# EAGLE design TreeV1Part2 (EAGLE 6.5.0)
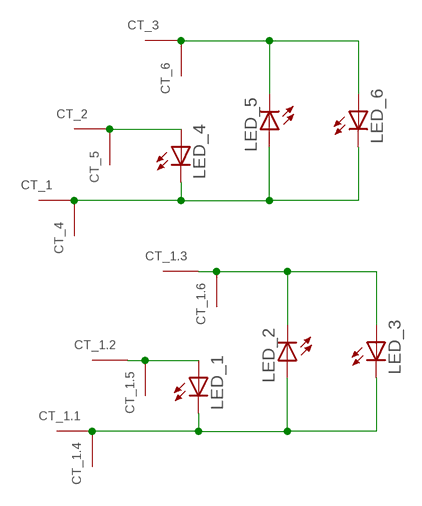
[diagram p0: schematic, sheet 1]

## Parts
CT_1  SMD_PAD_SINGLE  [5X5TREEPAD_SINGLE]
CT_1.1  SMD_PAD_SINGLE  [5X5TREEPAD_SINGLE]
CT_1.2  SMD_PAD_SINGLE  [5X5TREEPAD_SINGLE]
CT_1.3  SMD_PAD_SINGLE  [5X5TREEPAD_SINGLE]
CT_1.4  SMD_PAD_SINGLE  [5X5TREEPAD_SINGLE]
CT_1.5  SMD_PAD_SINGLE  [5X5TREEPAD_SINGLE]
CT_1.6  SMD_PAD_SINGLE  [5X5TREEPAD_SINGLE]
CT_2  SMD_PAD_SINGLE  [5X5TREEPAD_SINGLE]
CT_3  SMD_PAD_SINGLE  [5X5TREEPAD_SINGLE]
CT_4  SMD_PAD_SINGLE  [5X5TREEPAD_SINGLE]
CT_5  SMD_PAD_SINGLE  [5X5TREEPAD_SINGLE]
CT_6  SMD_PAD_SINGLE  [5X5TREEPAD_SINGLE]
LED_1  LEDLED_CLEAN_EDGE  [1X02_NO_SILK]
LED_2  LEDLED_CLEAN_EDGE  [1X02_NO_SILK]
LED_3  LEDLED_CLEAN_EDGE  [1X02_NO_SILK]
LED_4  LEDLED_CLEAN_EDGE  [1X02_NO_SILK]
LED_5  LEDLED_CLEAN_EDGE  [1X02_NO_SILK]
LED_6  LEDLED_CLEAN_EDGE  [1X02_NO_SILK]

## Nets
N$1: CT_3.P$1 CT_6.P$1 LED_5.2(C) LED_6.1(A)
N$2: CT_1.P$1 CT_4.P$1 LED_4.2(C) LED_5.1(A) LED_6.2(C)
N$3: CT_1.3.P$1 CT_1.6.P$1 LED_2.2(C) LED_3.1(A)
N$4: CT_2.P$1 CT_5.P$1 LED_4.1(A)
N$5: CT_1.1.P$1 CT_1.4.P$1 LED_1.2(C) LED_2.1(A) LED_3.2(C)
N$6: CT_1.2.P$1 CT_1.5.P$1 LED_1.1(A)

## Library data of the parts
CT_1 CT_1.1-CT_1.6 CT_2-CT_6 = Christmas2014Custom:SMD_PAD_SINGLE
LED_1-LED_6 = BergCustom:LED: LED OSRAM: - CHIPLED LG R971, LG N971, LY N971, LG Q971, LY Q971, LO R971, LY R971 LH N974, LH R974 LS Q976, LO Q976, LY Q976 LO Q996 - Hyper CHIPLED LW Q18S LB Q993, LB Q99A, LB R99A - SideLED LS A670, LO A670, LY A670, LG A670, LP A670 LB A673, LV A673, LT A673, LW A673 LH A674 LY A675 LS A676, LA A676, LO A676, LY A676, LW A676 LS A679, LY A679, LG A679 - Hyper Micro SIDELED® LS Y876, LA Y876, LO Y876, LY Y876 LT Y87S - SmartLED LW L88C, LW L88S LB L89C, LB L89S, LG L890 LS L89K, LO L89K, LY L89K LS L896, LA L896, LO L896, LY L896 - TOPLED LS T670, LO T670, LY T670, LG T670, LP T670 LSG T670, LSP T670, LSY T670, LOP T670, LYG T670 LG T671, LOG T671, LSG T671 LB T673, LV T673, LT T673, LW T673 LH T674 LS T676, LA T676, LO T676, LY T676, LB T676, LH T676, LSB T676, LW T676 LB T67C, LV T67C, LT T67C, LS T67K, LO T67K, LY T67K, LW E67C LS E67B, LA E67B, LO E67B, LY E67B, LB E67C, LV E67C, LT E67C LW T67C LS T679, LY T679, LG T679 LS T770, LO T770, LY T770, LG T770, LP T770 LB T773, LV T773, LT T773, LW T773 LH T774 LS E675, LA E675, LY E675, LS T675 LS T776, LA T776, LO T776, LY T776, LB T776 LHGB T686 LT T68C, LB T68C - Hyper Mini TOPLED® LB M676 - Mini TOPLED Santana® LG M470 LS M47K, LO M47K, LY M47K Source: http://www.osram.convergy.de LUXEON: - LUMILED® LXK2-PW12-R00, LXK2-PW12-S00, LXK2-PW14-U00, LXK2-PW14-V00 LXK2-PM12-R00, LXK2-PM12-S00, LXK2-PM14-U00 LXK2-PE12-Q00, LXK2-PE12-R00, LXK2-PE12-S00, LXK2-PE14-T00, LXK2-PE14-U00 LXK2-PB12-K00, LXK2-PB12-L00, LXK2-PB12-M00, LXK2-PB14-N00, LXK2-PB14-P00, LXK2-PB14-Q00 LXK2-PR12-L00, LXK2-PR12-M00, LXK2-PR14-Q00, LXK2-PR14-R00 LXK2-PD12-Q00, LXK2-PD12-R00, LXK2-PD12-S00 LXK2-PH12-R00, LXK2-PH12-S00 LXK2-PL12-P00, LXK2-PL12-Q00, LXK2-PL12-R00 Source: www.luxeon.com KINGBRIGHT: KA-3528ASYC Source: www.kingbright.com

## Board
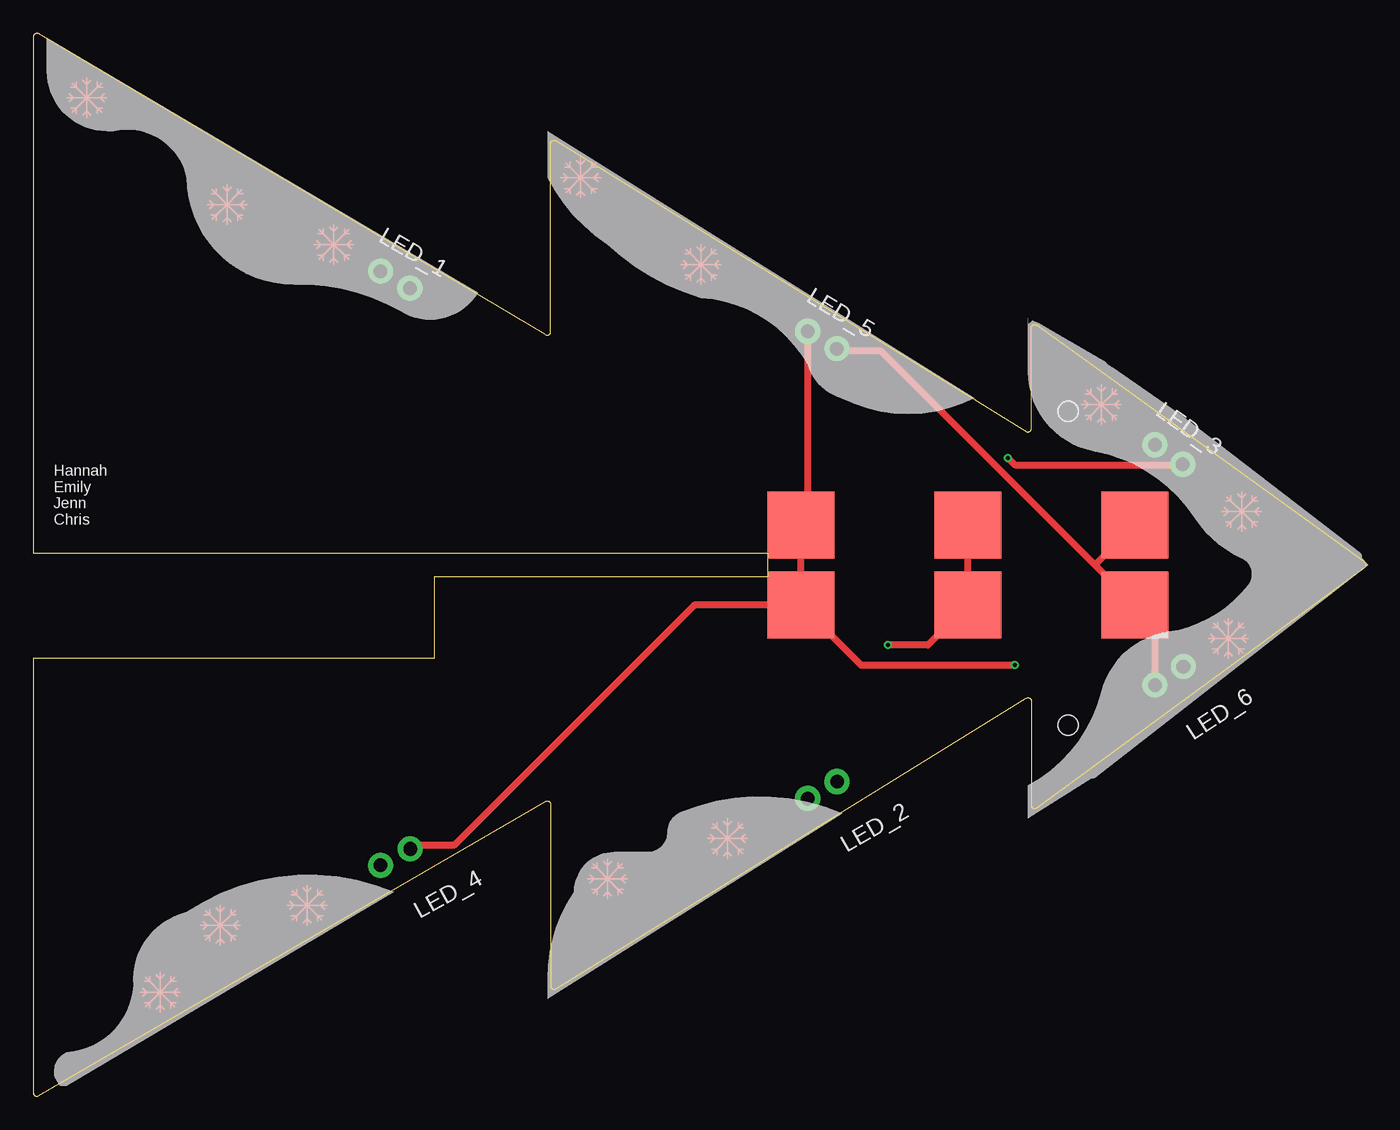
[diagram p1: board, top side]
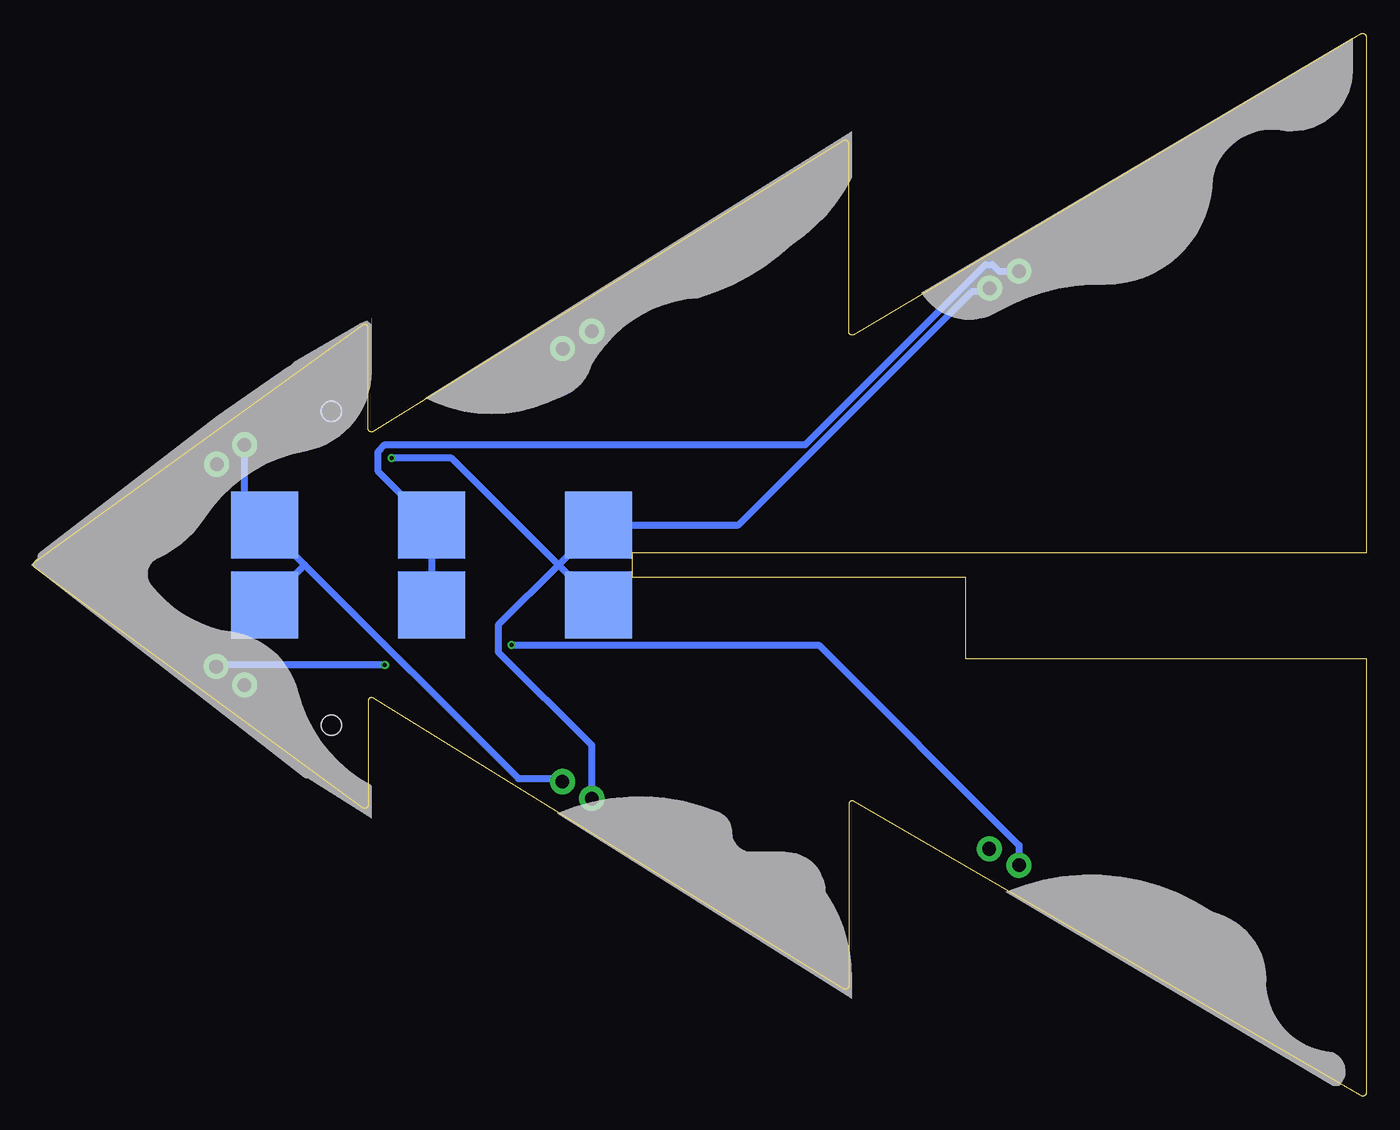
[diagram p2: board, bottom side, seen from below]

Size 99.82 x 79.62 mm. Coordinates in mm from the lower left corner, seen from the top.
Copper layers (1*16): Top 0.035mm / dielectric 1.5mm / Bottom 0.035mm
Design rules "Elecrow_2-layer_eagle_rule *": minimum track width 20mil, minimum drill 12mil, track to track 6mil, track to pad 6mil, pad to pad 6mil, via to via 6mil, smd to smd 0mil, copper to edge 10mil, drill to drill 10mil, minimum pad ring 10mil, minimum via ring 6mil, stop-mask expansion 2mil, vias tented up to drill 100mil, thermal gap 10mil
Holes 1.5 mm at 77.5,51.3 77.5,27.8

### Footprints (pad centres in the part's own frame; a part is rotated, then mirrored left to right if it is on the bottom)
5X5TREEPAD_SINGLE = smd 5 x 5: P$1 0,0
1X02_NO_SILK = drill 1.016 pad 1.88: 1 0,0; 2 2.54,0

### Placement (x,y rotation side)
CT_1  57.5,36.8 0 top
CT_1.1  57.5,36.8 0 bottom
CT_1.2  70,36.8 0 bottom
CT_1.3  82.5,36.8 0 bottom
CT_1.4  57.5,42.8 0 bottom
CT_1.5  70,42.8 0 bottom
CT_1.6  82.5,42.8 0 bottom
CT_2  70,36.8 0 top
CT_3  82.5,36.8 0 top
CT_4  57.5,42.8 0 top
CT_5  70,42.8 0 top
CT_6  82.5,42.8 0 top
LED_1  26,61.8 330 top
LED_2  58,22.3 30 top
LED_3  84,48.8 325 top
LED_4  26,17.3 29 top
LED_5  58,57.3 329 top
LED_6  84,30.8 33 top
U$1  [TREE_NOBATT]  0,79.81 270 top
U$2  [TREE_SNOW]  0,79.8 270 top
U$3  [SNOWFLAKE_1]  50,62.3 0 top
U$4  [SNOWFLAKE_1]  80,51.8 0 top
U$5  [SNOWFLAKE_1]  90.5,43.8 0 top
U$6  [SNOWFLAKE_1]  89.5,34.3 0 top
U$7  [SNOWFLAKE_1]  52,19.3 0 top
U$8  [SNOWFLAKE_1]  43,16.3 0 top
U$9  [SNOWFLAKE_1]  20.5,14.3 0 top
U$10  [SNOWFLAKE_1]  14,12.8 0 top
U$11  [SNOWFLAKE_1]  9.5,7.8 0 top
U$12  [SNOWFLAKE_1]  41,68.8 0 top
U$13  [SNOWFLAKE_1]  22.5,63.8 0 top
U$14  [SNOWFLAKE_1]  14.5,66.8 0 top
U$15  [SNOWFLAKE_1]  4,74.8 0 top

### Tracks (layer width: path | path; a pad name or v marks a point on that pad's centre or on a via)
N$1
  Top 0.508: LED_6.1 84,35.3 CT_3.P$1 79.5,39.8 | 79.5,39.8 63.5,55.8 60.5,55.8 LED_5.2 | 79.5,39.8 CT_6.P$1
N$2  (via drill 0.3)
  Top 0.508: LED_5.1 58,43.3 CT_4.P$1 CT_1.P$1 | CT_1.P$1 49.5,36.8 31.5,18.8 28.5,18.8 LED_4.2 | v73.5,32.3 62,32.3 CT_1.P$1
  Bottom 0.508: v73.5,32.3 86,32.3 LED_6.2
N$3
  Bottom 0.508: 79.5,39.8 CT_1.6.P$1 84,44.3 LED_3.1 | 79.5,39.8 63.5,23.8 60.5,23.8 LED_2.2 | 79.5,39.8 CT_1.3.P$1
N$4  (via drill 0.3)
  Top 0.508: v64,33.8 67,33.8 CT_2.P$1 CT_5.P$1
  Bottom 0.508: LED_4.1 26,18.8 41,33.8 v64,33.8
N$5  (via drill 0.3)
  Top 0.508: v73,47.8 73.5,47.3 86,47.3 LED_3.2
  Bottom 0.508: LED_1.2 28.5,60.3 29.5,60.3 47,42.8 CT_1.4.P$1 60.5,39.8 | LED_2.1 58,26.3 65,33.3 65,35.3 60.5,39.8 | v73,47.8 68.5,47.8 60.5,39.8 | 60.5,39.8 CT_1.1.P$1
N$6
  Bottom 0.508: LED_1.1 27.5,61.8 28,62.3 28.5,62.3 42,48.8 73.5,48.8 74,48.3 74,46.8 CT_1.5.P$1 CT_1.2.P$1

### Text on the board
tPlace: Hannah / Emily / Jenn / Chris